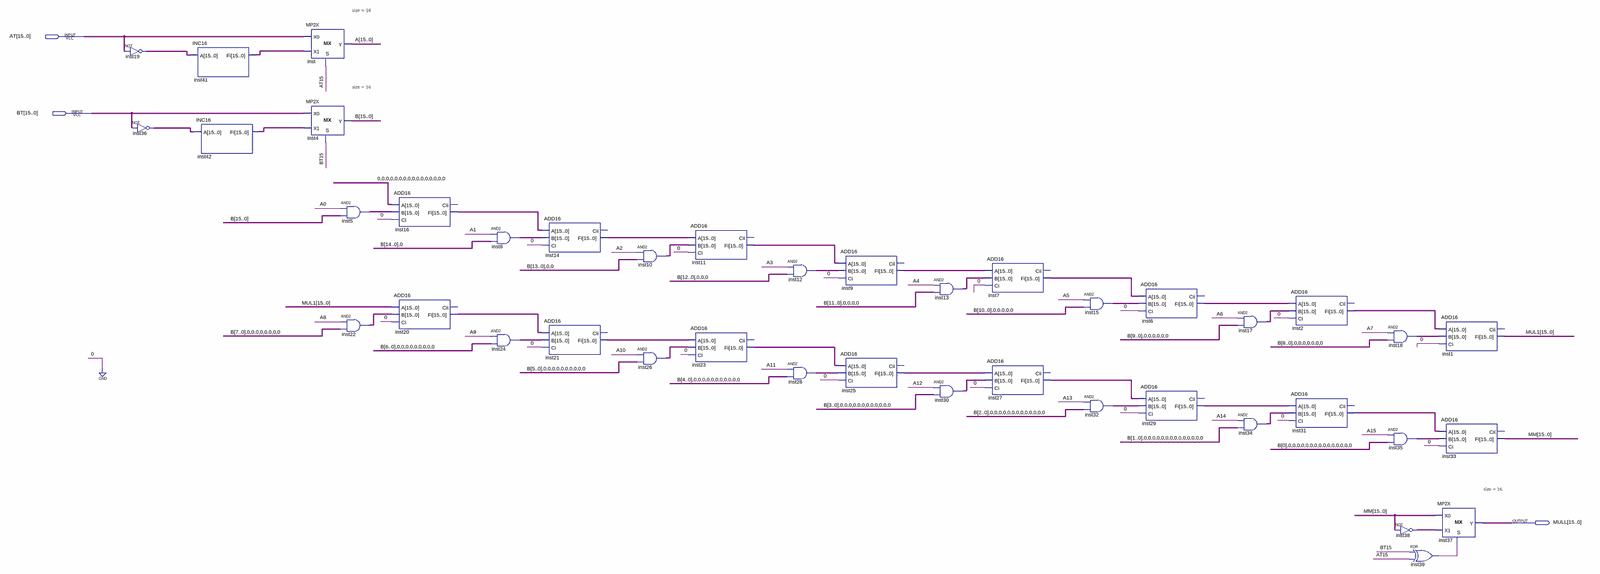
[diagram p0: schematic sheet, whole]
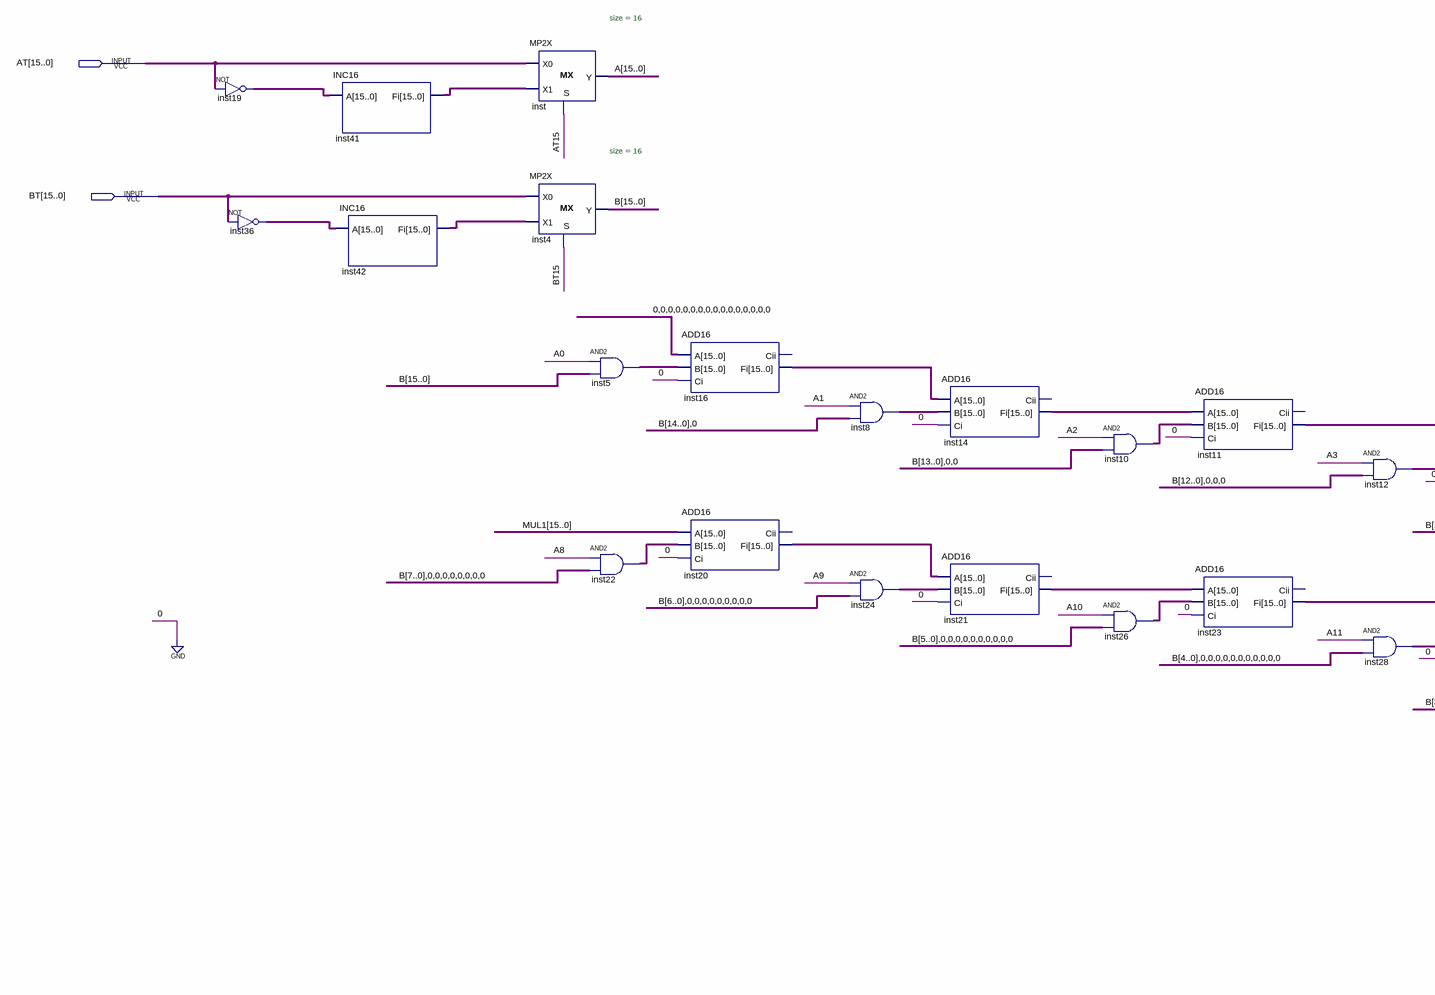
[diagram p1: schematic sheet, left part]
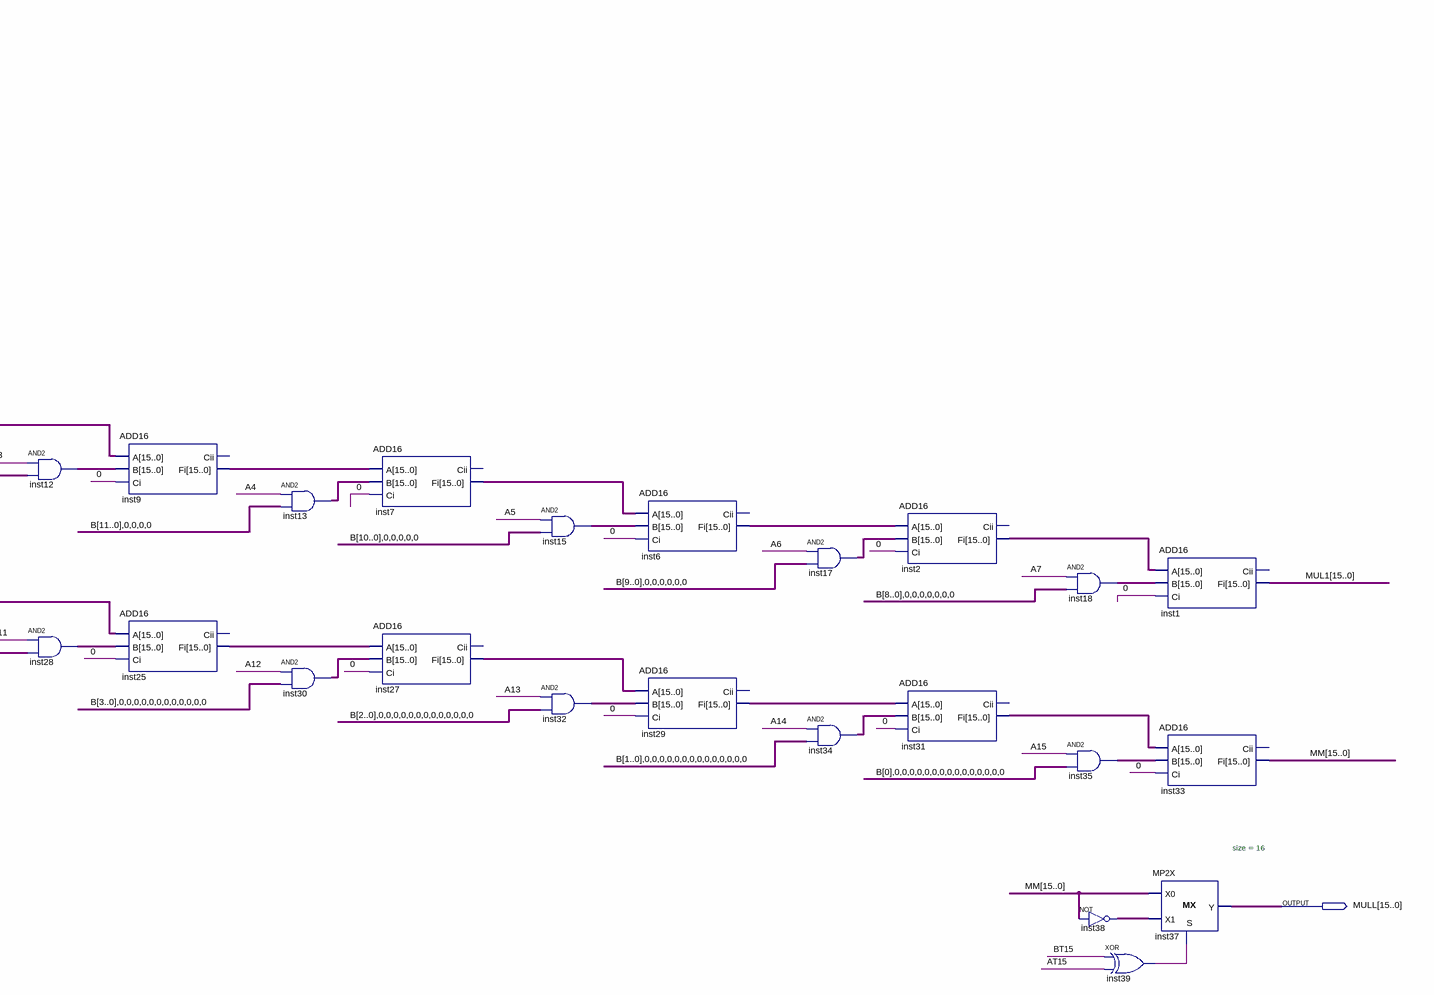
[diagram p2: schematic sheet, right part]
// Quartus schematic MUL16.bdf as structural Verilog: 41 symbols, 3 pins
module MUL16 (
  input  [15:0] AT,
  input  [15:0] BT,
  output [15:0] MULL
);

  wire inst39_out;
  wire [15:0] A, B, inst2_fi, inst5_out, inst6_fi, inst7_fi, inst8_out, inst9_fi, inst10_out, inst11_fi,
       inst12_out, inst13_out, inst14_fi, inst15_out, inst16_fi, inst17_out, inst18_out, inst19_out,
       inst20_fi, inst21_fi, inst22_out, inst23_fi, inst24_out, inst25_fi, inst26_out, inst27_fi, inst28_out,
       inst29_fi, inst30_out, inst31_fi, inst32_out, inst34_out, inst35_out, inst36_out, inst38_out,
       inst41_fi, inst42_fi, MM, MUL1;

  assign inst19_out = ~AT;  // NOT inst19, 16 bits wide
  assign inst36_out = ~BT;  // NOT inst36, 16 bits wide
  INC16 inst41 (.A(inst19_out), .Fi(inst41_fi));
  INC16 inst42 (.A(inst36_out), .Fi(inst42_fi));
  MP2X #(.size(16)) inst (.S(AT[15]), .X0(AT), .X1(inst41_fi), .Y(A));
  MP2X #(.size(16)) inst4 (.S(BT[15]), .X0(BT), .X1(inst42_fi), .Y(B));
  assign inst5_out = {16{A[0]}} & B;  // AND2 inst5, 16 bits wide
  assign inst22_out = {16{A[8]}} & {B[7:0], {8{1'b0}}};  // AND2 inst22, 16 bits wide
  ADD16 inst16 (.A({16{1'b0}}), .B(inst5_out), .Ci(1'b0), .Fi(inst16_fi));  // open: Cii
  ADD16 inst20 (.A(MUL1), .B(inst22_out), .Ci(1'b0), .Fi(inst20_fi));  // open: Cii
  assign inst8_out = {16{A[1]}} & {B[14:0], 1'b0};  // AND2 inst8, 16 bits wide
  assign inst24_out = {16{A[9]}} & {B[6:0], {9{1'b0}}};  // AND2 inst24, 16 bits wide
  ADD16 inst14 (.A(inst16_fi), .B(inst8_out), .Ci(1'b0), .Fi(inst14_fi));  // open: Cii
  ADD16 inst21 (.A(inst20_fi), .B(inst24_out), .Ci(1'b0), .Fi(inst21_fi));  // open: Cii
  assign inst10_out = {16{A[2]}} & {B[13:0], 2'b00};  // AND2 inst10, 16 bits wide
  assign inst26_out = {16{A[10]}} & {B[5:0], {10{1'b0}}};  // AND2 inst26, 16 bits wide
  ADD16 inst11 (.A(inst14_fi), .B(inst10_out), .Ci(1'b0), .Fi(inst11_fi));  // open: Cii
  ADD16 inst23 (.A(inst21_fi), .B(inst26_out), .Ci(1'b0), .Fi(inst23_fi));  // open: Cii
  assign inst12_out = {16{A[3]}} & {B[12:0], 3'b000};  // AND2 inst12, 16 bits wide
  assign inst28_out = {16{A[11]}} & {B[4:0], {11{1'b0}}};  // AND2 inst28, 16 bits wide
  ADD16 inst9 (.A(inst11_fi), .B(inst12_out), .Ci(1'b0), .Fi(inst9_fi));  // open: Cii
  ADD16 inst25 (.A(inst23_fi), .B(inst28_out), .Ci(1'b0), .Fi(inst25_fi));  // open: Cii
  assign inst13_out = {16{A[4]}} & {B[11:0], 4'b0000};  // AND2 inst13, 16 bits wide
  assign inst30_out = {16{A[12]}} & {B[3:0], {12{1'b0}}};  // AND2 inst30, 16 bits wide
  ADD16 inst7 (.A(inst9_fi), .B(inst13_out), .Ci(1'b0), .Fi(inst7_fi));  // open: Cii
  ADD16 inst27 (.A(inst25_fi), .B(inst30_out), .Ci(1'b0), .Fi(inst27_fi));  // open: Cii
  assign inst15_out = {16{A[5]}} & {B[10:0], {5{1'b0}}};  // AND2 inst15, 16 bits wide
  assign inst32_out = {16{A[13]}} & {B[2:0], {13{1'b0}}};  // AND2 inst32, 16 bits wide
  ADD16 inst6 (.A(inst7_fi), .B(inst15_out), .Ci(1'b0), .Fi(inst6_fi));  // open: Cii
  ADD16 inst29 (.A(inst27_fi), .B(inst32_out), .Ci(1'b0), .Fi(inst29_fi));  // open: Cii
  assign inst17_out = {16{A[6]}} & {B[9:0], {6{1'b0}}};  // AND2 inst17, 16 bits wide
  assign inst34_out = {16{A[14]}} & {B[1:0], {14{1'b0}}};  // AND2 inst34, 16 bits wide
  ADD16 inst2 (.A(inst6_fi), .B(inst17_out), .Ci(1'b0), .Fi(inst2_fi));  // open: Cii
  ADD16 inst31 (.A(inst29_fi), .B(inst34_out), .Ci(1'b0), .Fi(inst31_fi));  // open: Cii
  assign inst18_out = {16{A[7]}} & {B[8:0], {7{1'b0}}};  // AND2 inst18, 16 bits wide
  assign inst35_out = {16{A[15]}} & {B[0], {15{1'b0}}};  // AND2 inst35, 16 bits wide
  assign inst38_out = ~MM;  // NOT inst38, 16 bits wide
  xor inst39 (inst39_out, BT[15], AT[15]);
  ADD16 inst1 (.A(inst2_fi), .B(inst18_out), .Ci(1'b0), .Fi(MUL1));  // open: Cii
  ADD16 inst33 (.A(inst31_fi), .B(inst35_out), .Ci(1'b0), .Fi(MM));  // open: Cii
  MP2X #(.size(16)) inst37 (.S(inst39_out), .X0(MM), .X1(inst38_out), .Y(MULL));
endmodule
